# Altium schematic sheet Tray3.SchDoc
size A4
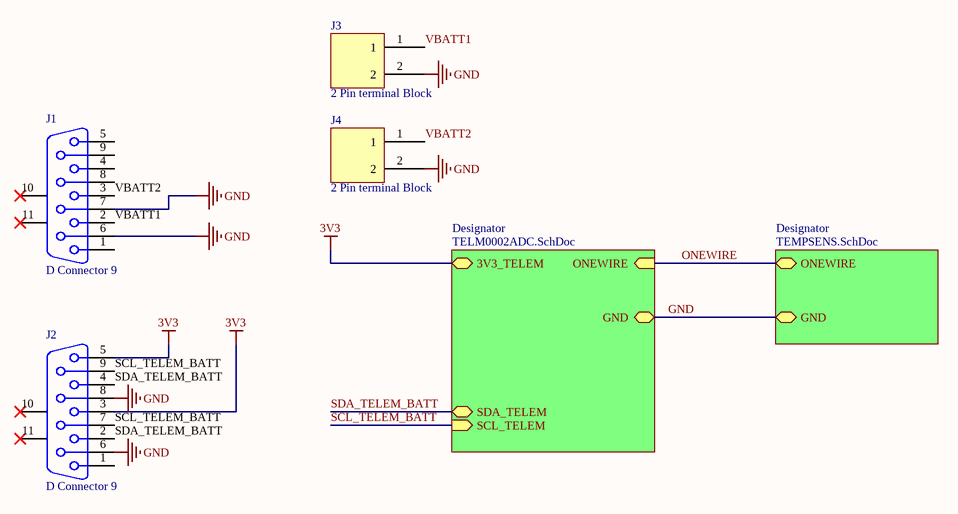
[diagram p0: Tray3.SchDoc]

## Parts
J1  D Connector 9  [DSUB Upright]
J2  D Connector 9  [DSUB Upright]
J3  2 Pin terminal Block  [5.05mm Terminal Block - 2]
J4  2 Pin terminal Block  [5.05mm Terminal Block - 2]

## Sub-sheets
Designator = TELM0002ADC.SchDoc: 3V3_TELEM, SDA_TELEM (bidir), ONEWIRE (in), GND, SCL_TELEM (in)
Designator = TEMPSENS.SchDoc: ONEWIRE (bidir), GND

## Nets
3V3: J2.3 J2.5 ; sheet Designator/3V3_TELEM
GND: J1.6 J1.7 J2.6 J2.8 J3.2 J4.2 ; sheet Designator/GND, sheet Designator/GND
ONEWIRE: sheet Designator/ONEWIRE, sheet Designator/ONEWIRE
SCL_TELEM_BATT: J2.7 J2.9 ; sheet Designator/SCL_TELEM
SDA_TELEM_BATT: J2.2 J2.4 ; sheet Designator/SDA_TELEM
VBATT1: J1.2 J3.1
VBATT2: J1.3 J4.1

Not connected (* = marked no-connect by the designer): J1 1 4 5 8 9 10(MH1)* 11(MH2)*; J2 1 10(MH1)* 11(MH2)*

## Library data of the parts
J1 J2 = D Connector 9: Receptacle Assembly, 9 Position, Right Angle; Supplier: Digikey
J3 J4 = 2 Terminal Block: Terminal Block, 5.08mm; Supplier: Digikey